# Altium schematic sheet NguyenLy.SchDoc
size A
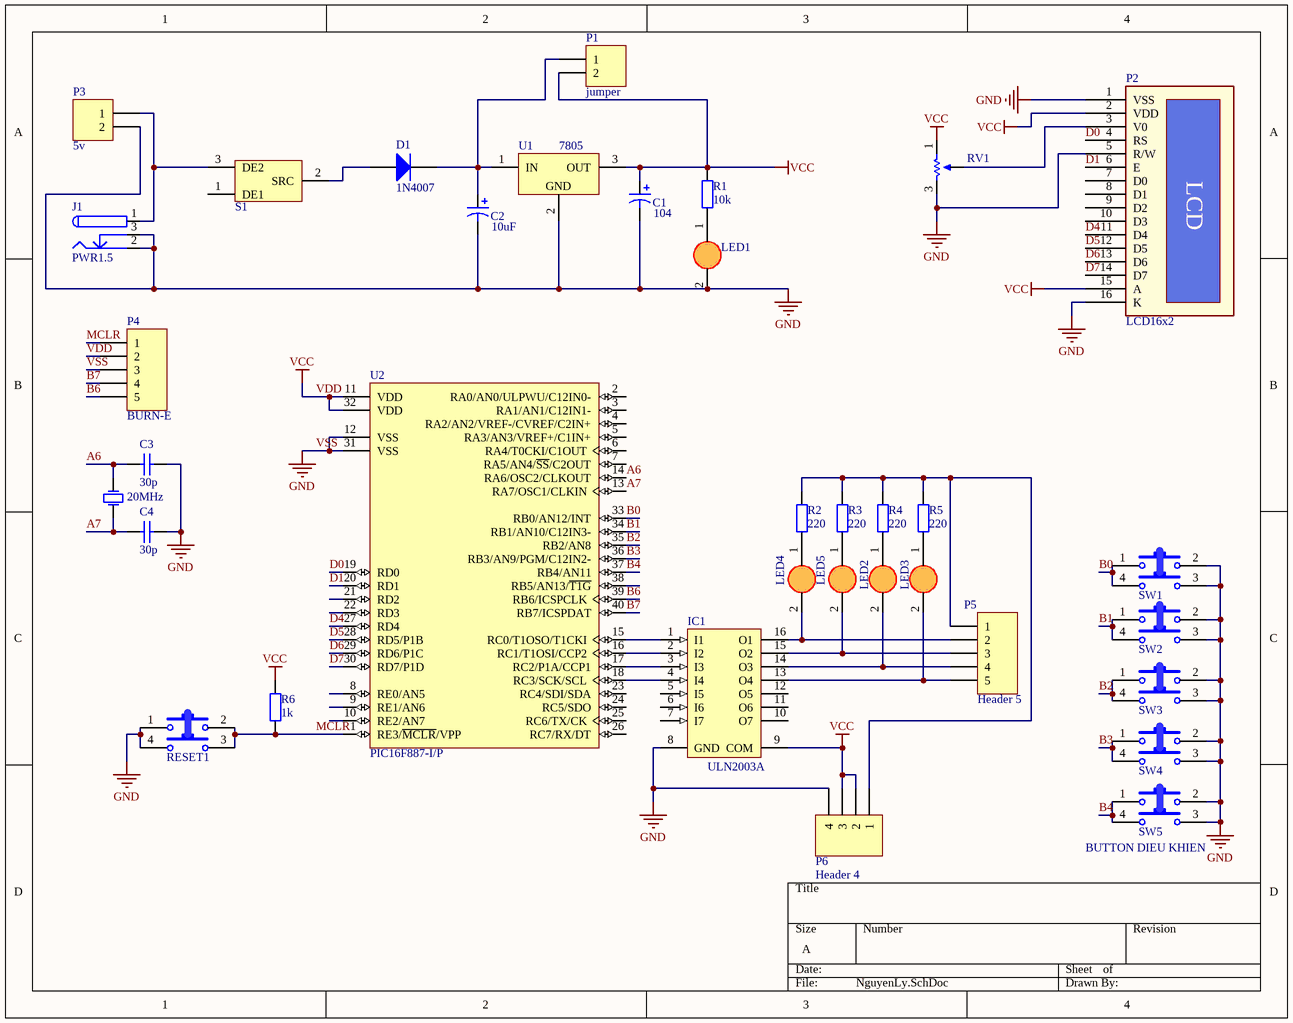
[diagram p0: NguyenLy.SchDoc]

## Parts
C1  104  [C3MM]
C2  10uF  [C3MM]
C3  value 30p  [Tu-ceramic]  (hidden comment: Capacitor Ceramic)
C4  value 30p  [Tu-ceramic]  (hidden comment: Capacitor Ceramic)
D1  1N4007  [DIODE/POW/1A]
IC1  ULN2003A  [DIP16/W0.3]
J1  PWR1.5  [PW-J-1MM]
LED1  LED5  [LED5MM]  (value not drawn)
LED2  LED5  [LED5MM]  (value not drawn)
LED3  LED5  [LED5MM]  (value not drawn)
LED4  LED5  [LED5MM]  (value not drawn)
LED5  LED5  [LED5MM]  (value not drawn)
P1  jumper  [HDR1X2]
P2  LCD16x2  [HDR1X16]
P3  5v  [HDR1X2]
P4  BURN-E  [HDR1X5]
P5  Header 5  [HDR1X5]
P6  Header 4  [HDR1X4]
R1  value 10k  [DIEN TRO 1/4 W]  (hidden comment: R0.4W)
R2  value 220  [DIEN TRO 1/4 W]  (hidden comment: R0.4W)
R3  value 220  [DIEN TRO 1/4 W]  (hidden comment: R0.4W)
R4  value 220  [DIEN TRO 1/4 W]  (hidden comment: R0.4W)
R5  value 220  [DIEN TRO 1/4 W]  (hidden comment: R0.4W)
R6  value 1k  [DIEN TRO 1/4 W]  (hidden comment: R0.4W)
RESET1  SW-4P-S  [SW-4P-S]  (value not drawn)
RV1  RV20K  [RVAR10K]  (value not drawn)
S1  Switch  [Switch]  (value not drawn)
SW1  SW-4P-S  [SW-4P-S]  (value not drawn)
SW2  SW-4P-S  [SW-4P-S]  (value not drawn)
SW3  SW-4P-S  [SW-4P-S]  (value not drawn)
SW4  SW-4P-S  [SW-4P-S]  (value not drawn)
SW5  SW-4P-S  [SW-4P-S]  (value not drawn)
U1  7805  [HDR1x3 BIG]
U2  PIC16F887-I/P  [PDIP600-P40]
Y1  20MHz  [XTAL]

## Nets
VDD: C1.1 IC1.9(COM) P1.2 P2.2(VDD) P2.15(A) P4.2 P6.2 P6.3 R1.2 R6.1 RV1.1 U1.3(OUT) U2.11(VDD) U2.32(VDD)  [also labelled VCC]
VSS: C1.2 C2.2 C3.2 C4.2 IC1.8(GND) J1.2 J1.3 LED1.2(K) P2.1(VSS) P2.5(R/W) P2.16(K) P3.2 P4.3 P6.4 RESET1.1 RESET1.4 RV1.3 SW1.2 SW1.3 SW2.2 SW2.3 SW3.2 SW3.3 SW4.2 SW4.3 SW5.2 SW5.3 U1.2(GND) U2.12(VSS) U2.31(VSS)  [also labelled GND]
A6: C3.1 U2.14(RA6/OSC2/CLKOUT) Y1.2(OSC2)
A7: C4.1 U2.13(RA7/OSC1/CLKIN) Y1.1(OSC1)
B0: SW1.1 SW1.4 U2.33(RB0/AN12/INT)
B1: SW2.1 SW2.4 U2.34(RB1/AN10/C12IN3-)
B2: SW3.1 SW3.4 U2.35(RB2/AN8)
B3: SW4.1 SW4.4 U2.36(RB3/AN9/PGM/C12IN2-)
B4: SW5.1 SW5.4 U2.37(RB4/AN11)
B6: P4.5 U2.39(RB6/ICSPCLK)
B7: P4.4 U2.40(RB7/ICSPDAT)
D0: P2.4(RS) U2.19(RD0)
D1: P2.6(E) U2.20(RD1)
D4: P2.11(D4) U2.27(RD4)
D5: P2.12(D5) U2.28(RD5/P1B)
D6: P2.13(D6) U2.29(RD6/P1C)
D7: P2.14(D7) U2.30(RD7/P1D)
MCLR: P4.1 R6.2 RESET1.2 RESET1.3 U2.1(RE3/~{MCLR}/VPP)
NetC2_1: C2.1 D1.2(K) P1.1 U1.1(IN)
NetD1_1: D1.1(A) S1.2(SRC)
NetIC1_1: IC1.1(I1) U2.15(RC0/T1OSO/T1CKI)
NetIC1_2: IC1.2(I2) U2.16(RC1/T1OSI/CCP2)
NetIC1_3: IC1.3(I3) U2.17(RC2/P1A/CCP1)
NetIC1_4: IC1.4(I4) U2.18(RC3/SCK/SCL)
NetIC1_13: IC1.13(O4) LED3.2(K) P5.5
NetIC1_14: IC1.14(O3) LED2.2(K) P5.4
NetIC1_15: IC1.15(O2) LED5.2(K) P5.3
NetIC1_16: IC1.16(O1) LED4.2(K) P5.2
NetJ1_1: J1.1 P3.1 S1.3(DE2)
NetLED1_1: LED1.1(A) R1.1
NetLED2_1: LED2.1(A) R4.1
NetLED3_1: LED3.1(A) R5.1
NetLED4_1: LED4.1(A) R2.1
NetLED5_1: LED5.1(A) R3.1
NetP2_3: P2.3(V0) RV1.2
NetP5_1: P5.1 P6.1 R2.2 R3.2 R4.2 R5.2

Not connected (* = marked no-connect by the designer): IC1 5(I5) 6(I6) 7(I7) 10(O7) 11(O6) 12(O5); P2 7(D0) 8(D1) 9(D2) 10(D3); S1 1(DE1) 4 5; U2 2(RA0/AN0/ULPWU/C12IN0-) 3(RA1/AN1/C12IN1-) 4(RA2/AN2/VREF-/CVREF/C2IN+) 5(RA3/AN3/VREF+/C1IN+) 6(RA4/T0CKI/C1OUT) 7(RA5/AN4/~{SS}/C2OUT) 8(RE0/AN5) 9(RE1/AN6) 10(RE2/AN7) 21(RD2) 22(RD3) 23(RC4/SDI/SDA) 24(RC5/SDO) 25(RC6/TX/CK) 26(RC7/RX/DT) 38(RB5/AN13/~{T1G})

## Notes on the sheet
- (near SW5) BUTTON DIEU KHIEN
- (in symbol LCD Text) LCD

## Library data of the parts
C1 C2 = Cap Pol 3mm: Polarized Capacitor (Axial); Published: 8-Jun-2000; LatestRevisionDate: 17-Jul-2002; LatestRevisionNote: Re-released for DXP Platform.; PackageReference: POLAR0.8; Publisher: Altium Limited
C3 C4 = CapDecop: Capacitor; Published: 8-Jun-2000; LatestRevisionDate: 17-Jul-2002; LatestRevisionNote: Re-released for DXP Platform.; PackageReference: RAD-0.3; Publisher: Altium Limited
D1 = Diode Power: Published: 8-Jun-2000; LatestRevisionDate: 17-Jul-2002; LatestRevisionNote: Re-released for DXP Platform.; DatasheetDocument: 1998; PackageDocument: Aug-1999; PackageReference: DO-201AD; Publisher: Altium Limited; ComponentLink1Description: Manufacturer Link; ComponentLink1URL: http://www.fairchildsemi.com/; ComponentLink2Description: Datasheet; ComponentLink2URL: http://www.fairchildsemi.com/ds/1N%2F1N5400.pdf
IC1 = ULN2003A: High-Voltage, High-Current Darlington Array; LatestRevisionNote: Stylized 3D Model Added.; Publisher: Altium Limited; Value: ULN2003A
J1 = PWR1.5: Low Voltage Power Supply Connector; Published: 17-Dec-2003; DatasheetDocument: 09-May-2002; Publisher: Altium Limited; ComponentLink1Description: Manufacturer Link; ComponentLink1URL: http://domino.kycon.com/internet/Products.html
LED1-LED5 = LED 5mm
P1 P3 = Header 2: Header, 2-Pin; LatestRevisionDate: 17-Jul-2002; LatestRevisionNote: Re-released for DXP Platform.; Publisher: Altium Limited
P2 = LCD Text
P4 P5 = Header 5: Header, 5-Pin; LatestRevisionDate: 17-Jul-2002; LatestRevisionNote: Re-released for DXP Platform.; Publisher: Altium Limited
P6 = Header 4: Header, 4-Pin; LatestRevisionDate: 17-Jul-2002; LatestRevisionNote: Re-released for DXP Platform.; Publisher: Altium Limited
R1-R6 = Res 1/4 W: Resistor; Published: 8-Jun-2000; LatestRevisionDate: 17-Jul-2002; LatestRevisionNote: Re-released for DXP Platform.; PackageReference: AXIAL-0.4; Publisher: Altium Limited
RESET1 SW1-SW5 = SW-4PIN-SMALL: Switch Small 4 Pin; Published: 24-Mar-1999; LatestRevisionDate: 17-Jul-2002; LatestRevisionNote: Re-released for DXP Platform.; PackageReference: SPST-2; Publisher: Altium Limited
RV1 = Variable Resistor: Sim Note: Enter the Resistance value and the set point into parameter fields.; Set Position: 0.5; Published: 8-Jun-2000; LatestRevisionDate: 17-Jul-2002; LatestRevisionNote: Re-released for DXP Platform.; PackageReference: VR5; Publisher: Altium Limited
U1 = 7809: Positive Voltage Regulator; Note: Tab is connected to pin 3 (GND).; Published: 24-Aug-2001; LatestRevisionDate: 17-Jul-2002; LatestRevisionNote: Re-released for DXP Platform.; DatasheetVersion: Apr-1994; PackageReference: SOT82C; Publisher: Altium Limited; PackageDescription: SIP; 3 Leads; Body 10.9 x 7.6 x 2.6 mm (typ); Pitch 2.2 mm; ComponentLink1Description: Manufacturer Link; ComponentLink1URL: http://www.st.com/; ComponentLink2Description: Datasheet; ComponentLink2URL: http://www.st.com/stonline/products/literature/ds/2146/l78m05c.pdf
U2 = PIC16F887-I/P: Flash-Based, 8-Bit CMOS Microcontroller with nanoWatt Technology, 8K (x14-Bit words) Program Memory, 624 Bytes Data Memory, 35 I/O pins, 40-Pin PDIP, Standard VDD Range, Industrial Temperature; Published: 29-Jan-2009; LatestRevisionDate: 02-Dec-2009; LatestRevisionNote: Updated datasheet to version revF, Apr-2009.; DatasheetVersion: revF, Apr-2009; PackageVersion: revBB, Aug-2009; PackageReference: PDIP600-P40; Publisher: Altium Limited; PackageDescription: 40-Lead Plastic Dual In-Line (P) - 600 mil Body [PDIP]; Supplier 1: Digi-Key; Supplier Part Number 1: PIC16F887-I/P-ND; Supplier 2: Farnell; Supplier Part Number 2: 1439541; ComponentLink1Description: Datasheet; ComponentLink1URL: http://ww1.microchip.com/downloads/en/DeviceDoc/41291F.pdf; ComponentLink2Description: Packaging Specification; ComponentLink2URL: http://www.microchip.com/stellent/groups/techpub_sg/documents/packagingspec/en012702.pdf; ComponentLink3Description: Microchip.com Home; ComponentLink3URL: http://www.microchip.com/
Y1 = XTAL: Crystal Oscillator; Published: 8-Jun-2000; LatestRevisionDate: 17-Jul-2002; LatestRevisionNote: Re-released for DXP Platform.; PackageReference: R38; Publisher: Altium Limited